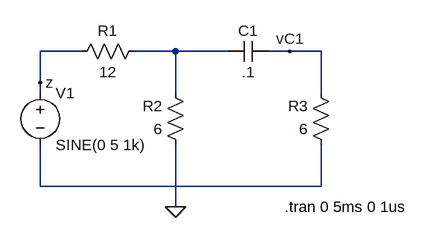
[diagram p0: schematic Draft2.asc]
Draft2.asc, the LTspice schematic file:
Version 4
SHEET 1 880 680
WIRE 96 96 32 96
WIRE 240 96 176 96
WIRE 320 96 240 96
WIRE 416 96 384 96
WIRE 464 96 416 96
WIRE 32 144 32 96
WIRE 32 160 32 144
WIRE 240 160 240 96
WIRE 464 160 464 96
WIRE 32 304 32 240
WIRE 464 304 464 240
WIRE 464 304 32 304
WIRE 240 336 240 240
FLAG 240 336 0
FLAG 416 96 vC1
FLAG 32 144 z
SYMBOL res 192 80 R90
WINDOW 0 0 56 VBottom 2
WINDOW 3 32 56 VTop 2
SYMATTR InstName R1
SYMATTR Value 12
SYMBOL cap 384 80 R90
WINDOW 0 0 32 VBottom 2
WINDOW 3 32 32 VTop 2
SYMATTR InstName C1
SYMATTR Value .1
SYMBOL res 256 256 R180
WINDOW 0 36 76 Left 2
WINDOW 3 36 40 Left 2
SYMATTR InstName R2
SYMATTR Value 6
SYMBOL res 480 256 R180
WINDOW 0 36 76 Left 2
WINDOW 3 36 40 Left 2
SYMATTR InstName R3
SYMATTR Value 6
SYMBOL voltage 32 144 R0
WINDOW 123 0 0 Left 0
WINDOW 39 0 0 Left 0
SYMATTR InstName V1
SYMATTR Value SINE(0 5 1k)
TEXT 408 336 Left 2 !.tran 0 5ms 0 1us

The netlist it stands for:
* Draft2.asc
R1 N001 z 12
C1 vC1 N001 .1
R2 0 N001 6
R3 N002 vC1 6
V1 z N002 SINE(0 5 1k)
.tran 0 5ms 0 1us
.backanno
.end

* Results of the author's LTspice run, read from the files saved beside the schematic
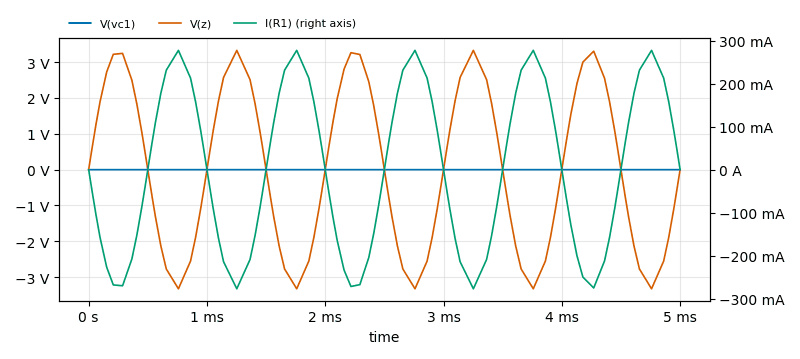
[diagram p1: Transient Analysis of Draft2.asc, plotted from the saved traces]
* Transient Analysis, 1 run:
*   V(vc1): min -884 µV, max 1.226 µV, average -441.5 µV, rms 544.2 µV, last 1.226 µV
*   V(z): min -3.325 V, max 3.328 V, average 2.76 mV, rms 2.313 V, last 817.6 nV
*   I(R1): min -277.3 mA, max 277.1 mA, average -230 µA, rms 192.8 mA, last -68.13 nA